# Altium schematic sheet tia-channel-selection.SchDoc: TIA Channel Selection
size A4; DrawnBy: Dylan Vogel; Organization: UTAT SS; DocumentNumber: 7; Revision: 2; SheetNumber: 7; SheetTotal: 13
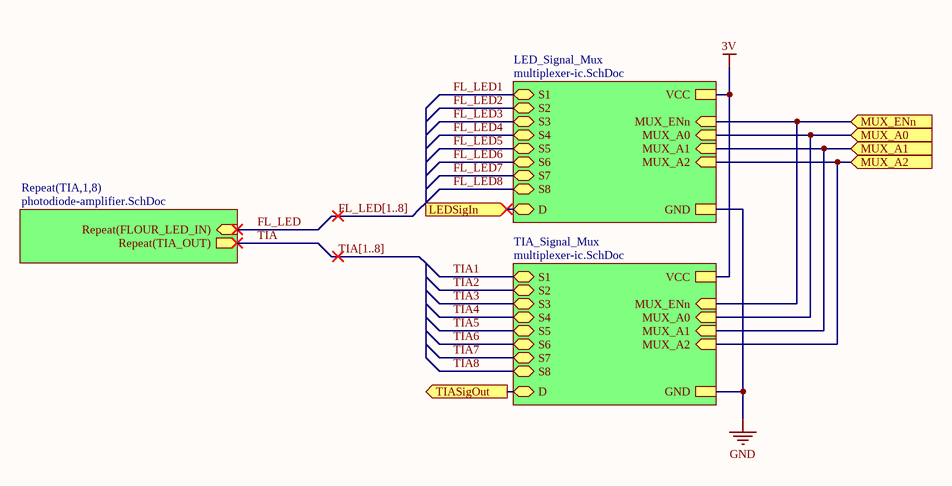
[diagram p0: tia-channel-selection.SchDoc]

## Sub-sheets
LED_Signal_Mux = multiplexer-ic.SchDoc: S7 (bidir), D (bidir), S3 (bidir), S1 (bidir), S4 (bidir), MUX_ENn (in), S2 (bidir), VCC, GND, S8 (bidir), S6 (bidir), MUX_A1 (in), MUX_A0 (in), S5 (bidir), MUX_A2 (in)
Repeat(TIA,1,8) = photodiode-amplifier.SchDoc: Repeat(FLOUR_LED_IN) (in), Repeat(TIA_OUT) (out)
TIA_Signal_Mux = multiplexer-ic.SchDoc: S7 (bidir), D (bidir), S3 (bidir), S1 (bidir), S4 (bidir), MUX_ENn (in), S2 (bidir), VCC, GND, S8 (bidir), S6 (bidir), MUX_A1 (in), MUX_A0 (in), S5 (bidir), MUX_A2 (in)

## Ports
LEDSigIn (in), MUX_A0 (in), MUX_A1 (in), MUX_A2 (in), MUX_ENn (in), TIASigOut (out)

## Nets
3V: sheet TIA_Signal_Mux/VCC, sheet LED_Signal_Mux/VCC
GND: sheet TIA_Signal_Mux/GND, sheet LED_Signal_Mux/GND
FL_LED: sheet Repeat(TIA,1,8)/Repeat(FLOUR_LED_IN)
FL_LED1: sheet LED_Signal_Mux/S1
FL_LED2: sheet LED_Signal_Mux/S2
FL_LED3: sheet LED_Signal_Mux/S3
FL_LED4: sheet LED_Signal_Mux/S4
FL_LED5: sheet LED_Signal_Mux/S5
FL_LED6: sheet LED_Signal_Mux/S6
FL_LED7: sheet LED_Signal_Mux/S7
FL_LED8: sheet LED_Signal_Mux/S8
LEDSigIn: port LEDSigIn, sheet LED_Signal_Mux/D
MUX_A0: port MUX_A0, sheet TIA_Signal_Mux/MUX_A0, sheet LED_Signal_Mux/MUX_A0
MUX_A1: port MUX_A1, sheet TIA_Signal_Mux/MUX_A1, sheet LED_Signal_Mux/MUX_A1
MUX_A2: port MUX_A2, sheet TIA_Signal_Mux/MUX_A2, sheet LED_Signal_Mux/MUX_A2
MUX_ENn: port MUX_ENn, sheet TIA_Signal_Mux/MUX_ENn, sheet LED_Signal_Mux/MUX_ENn
TIA: sheet Repeat(TIA,1,8)/Repeat(TIA_OUT)
TIA1: sheet TIA_Signal_Mux/S1
TIA2: sheet TIA_Signal_Mux/S2
TIA3: sheet TIA_Signal_Mux/S3
TIA4: sheet TIA_Signal_Mux/S4
TIA5: sheet TIA_Signal_Mux/S5
TIA6: sheet TIA_Signal_Mux/S6
TIA7: sheet TIA_Signal_Mux/S7
TIA8: sheet TIA_Signal_Mux/S8
TIASigOut: port TIASigOut, sheet TIA_Signal_Mux/D

## Buses and harness runs
bus FL_LED[1..8]
bus TIA[1..8]